# EAGLE design coin20mm (EAGLE 6.6.0)
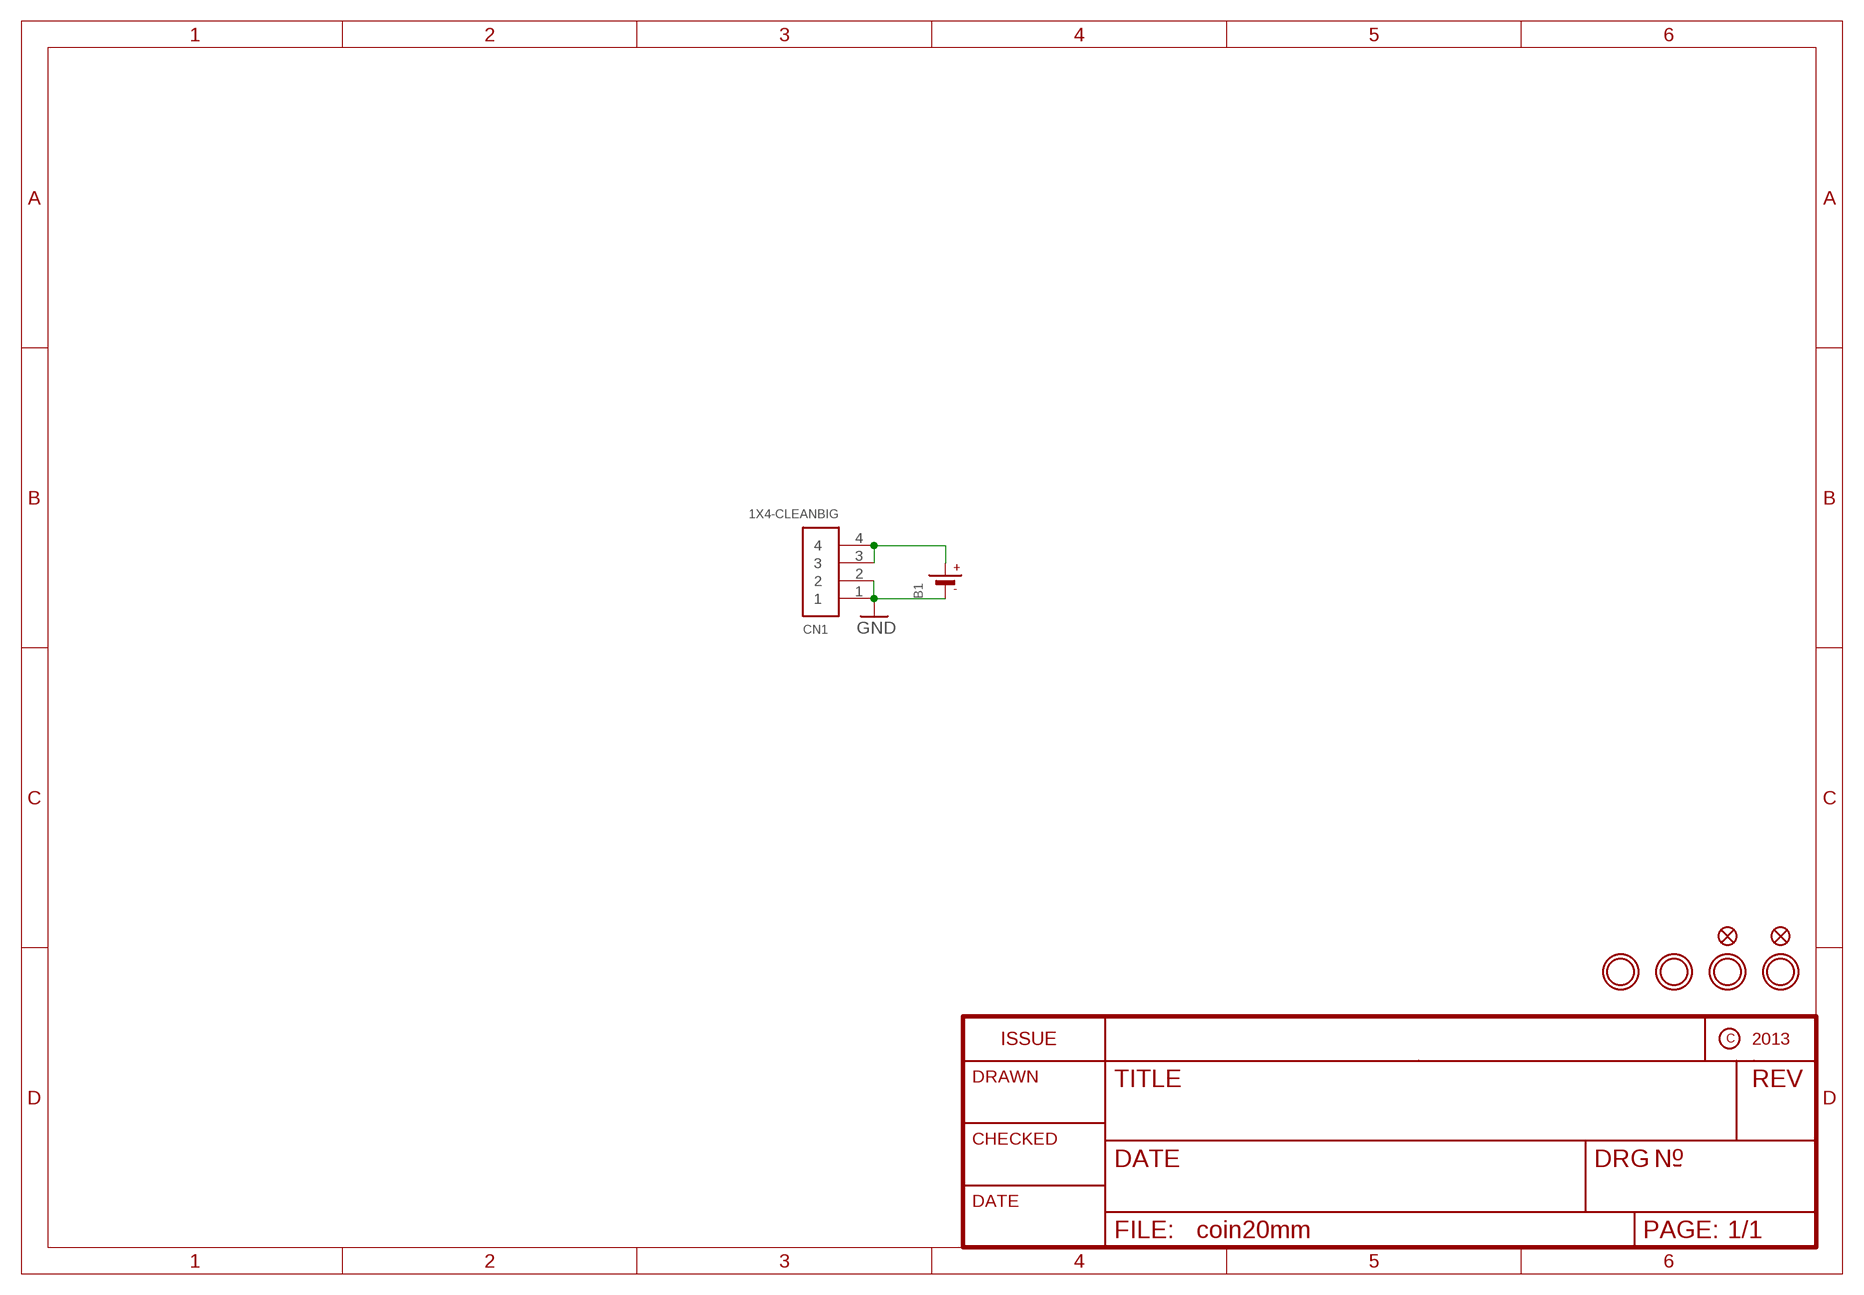
[diagram p0: schematic, sheet 1]

## Parts
B1  BATTERYCR2032_BAT-HLD-001  [CR2032_SMT_BAT-HLD-001]
CN1  1X4-CLEANBIG  [1X04-CLEANBIG]
FID1  FIDUCIAL""  [FIDUCIAL_1MM]
FID2  FIDUCIAL""  [FIDUCIAL_1MM]
U$1  MOUNTINGHOLE2.5  [MOUNTINGHOLE_2.5_PLATED]
U$2  MOUNTINGHOLE2.5  [MOUNTINGHOLE_2.5_PLATED]
U$3  MOUNTINGHOLE2.5  [MOUNTINGHOLE_2.5_PLATED]
U$5  MOUNTINGHOLE2.5  [MOUNTINGHOLE_2.5_PLATED]

## Nets
3V: B1.+$1(+) B1.+$2(+) CN1.3 CN1.4
GND: B1.- CN1.1 CN1.2

## Library data of the parts
B1 = microbuilder:BATTERY: CR1220 SMT - Digikey: 3001K-ND CD2032 BAT-HLD-001 - Digikey: BAT-HLD-001-ND
CN1 = adafruit2:1X4: 4-pin connector
FID1 FID2 = microbuilder:FIDUCIAL: Fiducial Alignment Points Various fiducial points for machine vision alignment.; BOM: EXCLUDE
U$1-U$3 U$5 = microbuilder:MOUNTINGHOLE: Mounting Hole For #2 screws (0.086"/2.18mm width, 0.094"/2.4mm hole) use 2.5mm; BOM: EXCLUDE

## Board
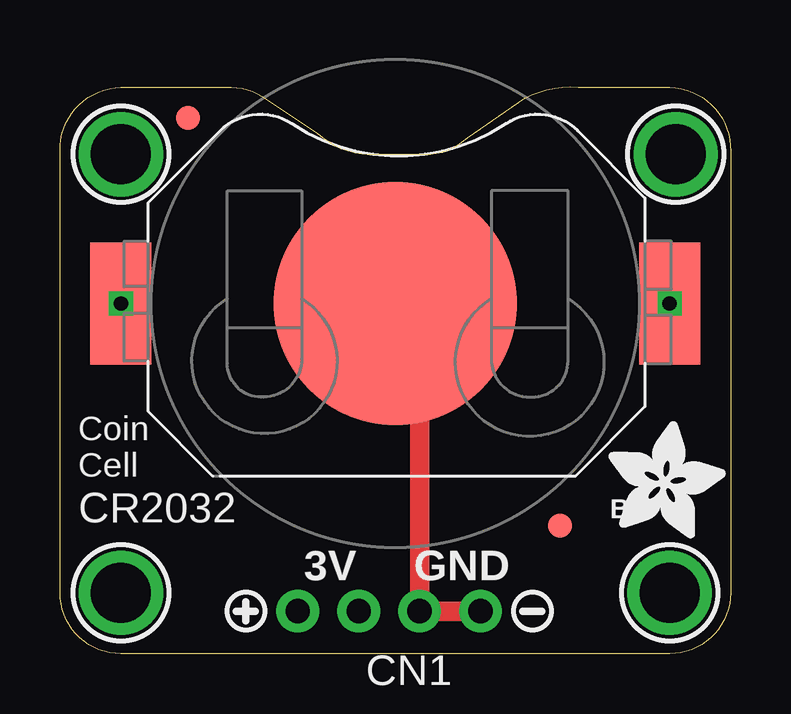
[diagram p1: board, top side]
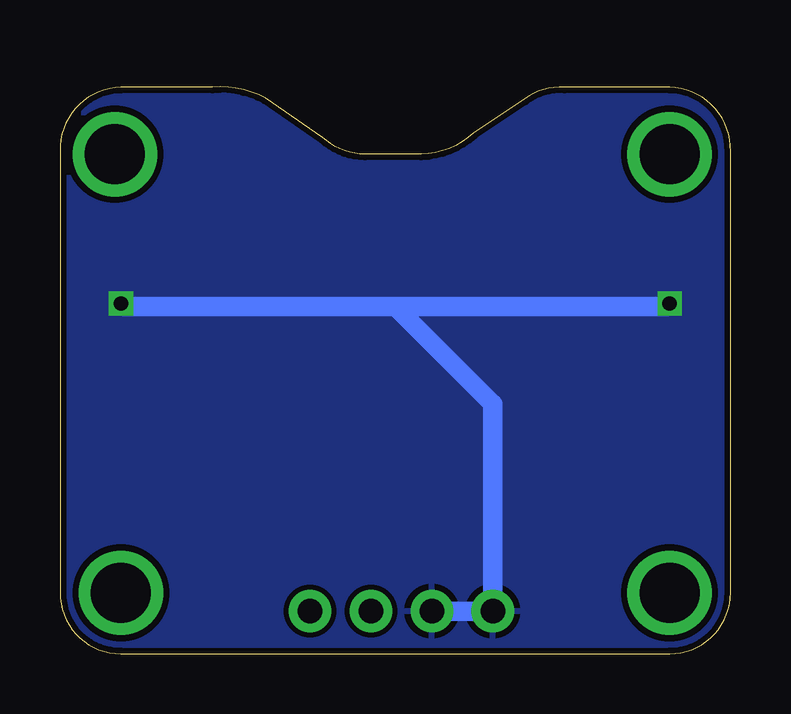
[diagram p2: board, bottom side, seen from below]

Size 27.94 x 23.64 mm. Coordinates in mm from the lower left corner, seen from the top.
Outline: 0,2.54 0,20.95 arc-90 2.54,23.62 6.92,23.62 arc-41 8.59,23.12 10.71,21.71 arc41 12.89,20.83 15.24,20.83 arc44 16.99,21.53 18.82,22.79 arc-44 21.59,23.62 25.4,23.62 arc-90 27.94,20.95 27.94,2.54 arc-90 25.4,0 2.54,0 arc-90 0,2.54
Copper layers (1*16): Top 0.035mm / dielectric 1.5mm / Bottom 0.035mm
Design rules "default": minimum track width 10mil, minimum drill 16mil, track to track 8mil, track to pad 8mil, pad to pad 8mil, via to via 8mil, smd to smd 8mil, copper to edge 10mil, drill to drill 8mil, minimum pad ring 10mil, minimum via ring 8mil, stop-mask expansion 4mil, vias tented up to drill 20mil, thermal gap 10mil

### Footprints (pad centres in the part's own frame; a part is rotated, then mirrored left to right if it is on the bottom)
CR2032_SMT_BAT-HLD-001 = smd 2.54 x 5.08: +$1 -11.43,0; +$2 11.43,0 | smd 10.16 x 10.16: - 0,0
1X04-CLEANBIG = drill 1.016 pad 1.778: 1 -3.81,0; 2 -1.27,0; 3 1.27,0; 4 3.81,0
FIDUCIAL_1MM = smd 1 x 1: 1 0,0
MOUNTINGHOLE_2.5_PLATED = drill 2.5 pad 3.2: P$1 0,0

### Placement (x,y rotation side)
B1  13.97,14.61 180 top
CN1  13.72,1.78 180 top
FID1  20.83,5.33 0 top
FID2  5.33,22.35 0 top
U$1  2.54,20.83 0 top
U$2  25.65,20.83 0 top
U$3  2.54,2.54 0 top
U$4  [ADAFRUIT_5MM]  22.86,4.83 0 top
U$5  25.4,2.54 0 top
U$6  [SYMBOL_PLUS]  7.75,1.78 0 top
U$7  [SYMBOL_MINUS]  19.68,1.78 0 top

### Tracks (layer width: path | path; a pad name or v marks a point on that pad's centre or on a via)
3V  (via drill 0.6)
  Top 0.406: 2.29,15.24 2.29,14.86 B1.+$2
  Top 0.813: B1.+$2 2.54,14.99 2.29,15.24 | B1.+$1 25.4,14.99 25.65,15.24
  Bottom 0.813: CN1.3 CN1.4 9.91,10.41 13.97,14.48 | 13.97,14.48 2.67,14.48 B1.+$2 | 13.97,14.48 25.27,14.48 B1.+$1
  other vias: 2.54,14.61 25.4,14.61
  pour Bottom: 0,0 0,23.88 28.45,23.88 28.45,0
GND
  Top 0.813: B1.- arc-90 14.99,13.59 CN1.2 CN1.1

### Text on the board
tPlace: Coin / Cell | CR2032 | 3V | GND